# Altium schematic sheet Mcu.SchDoc
size A2
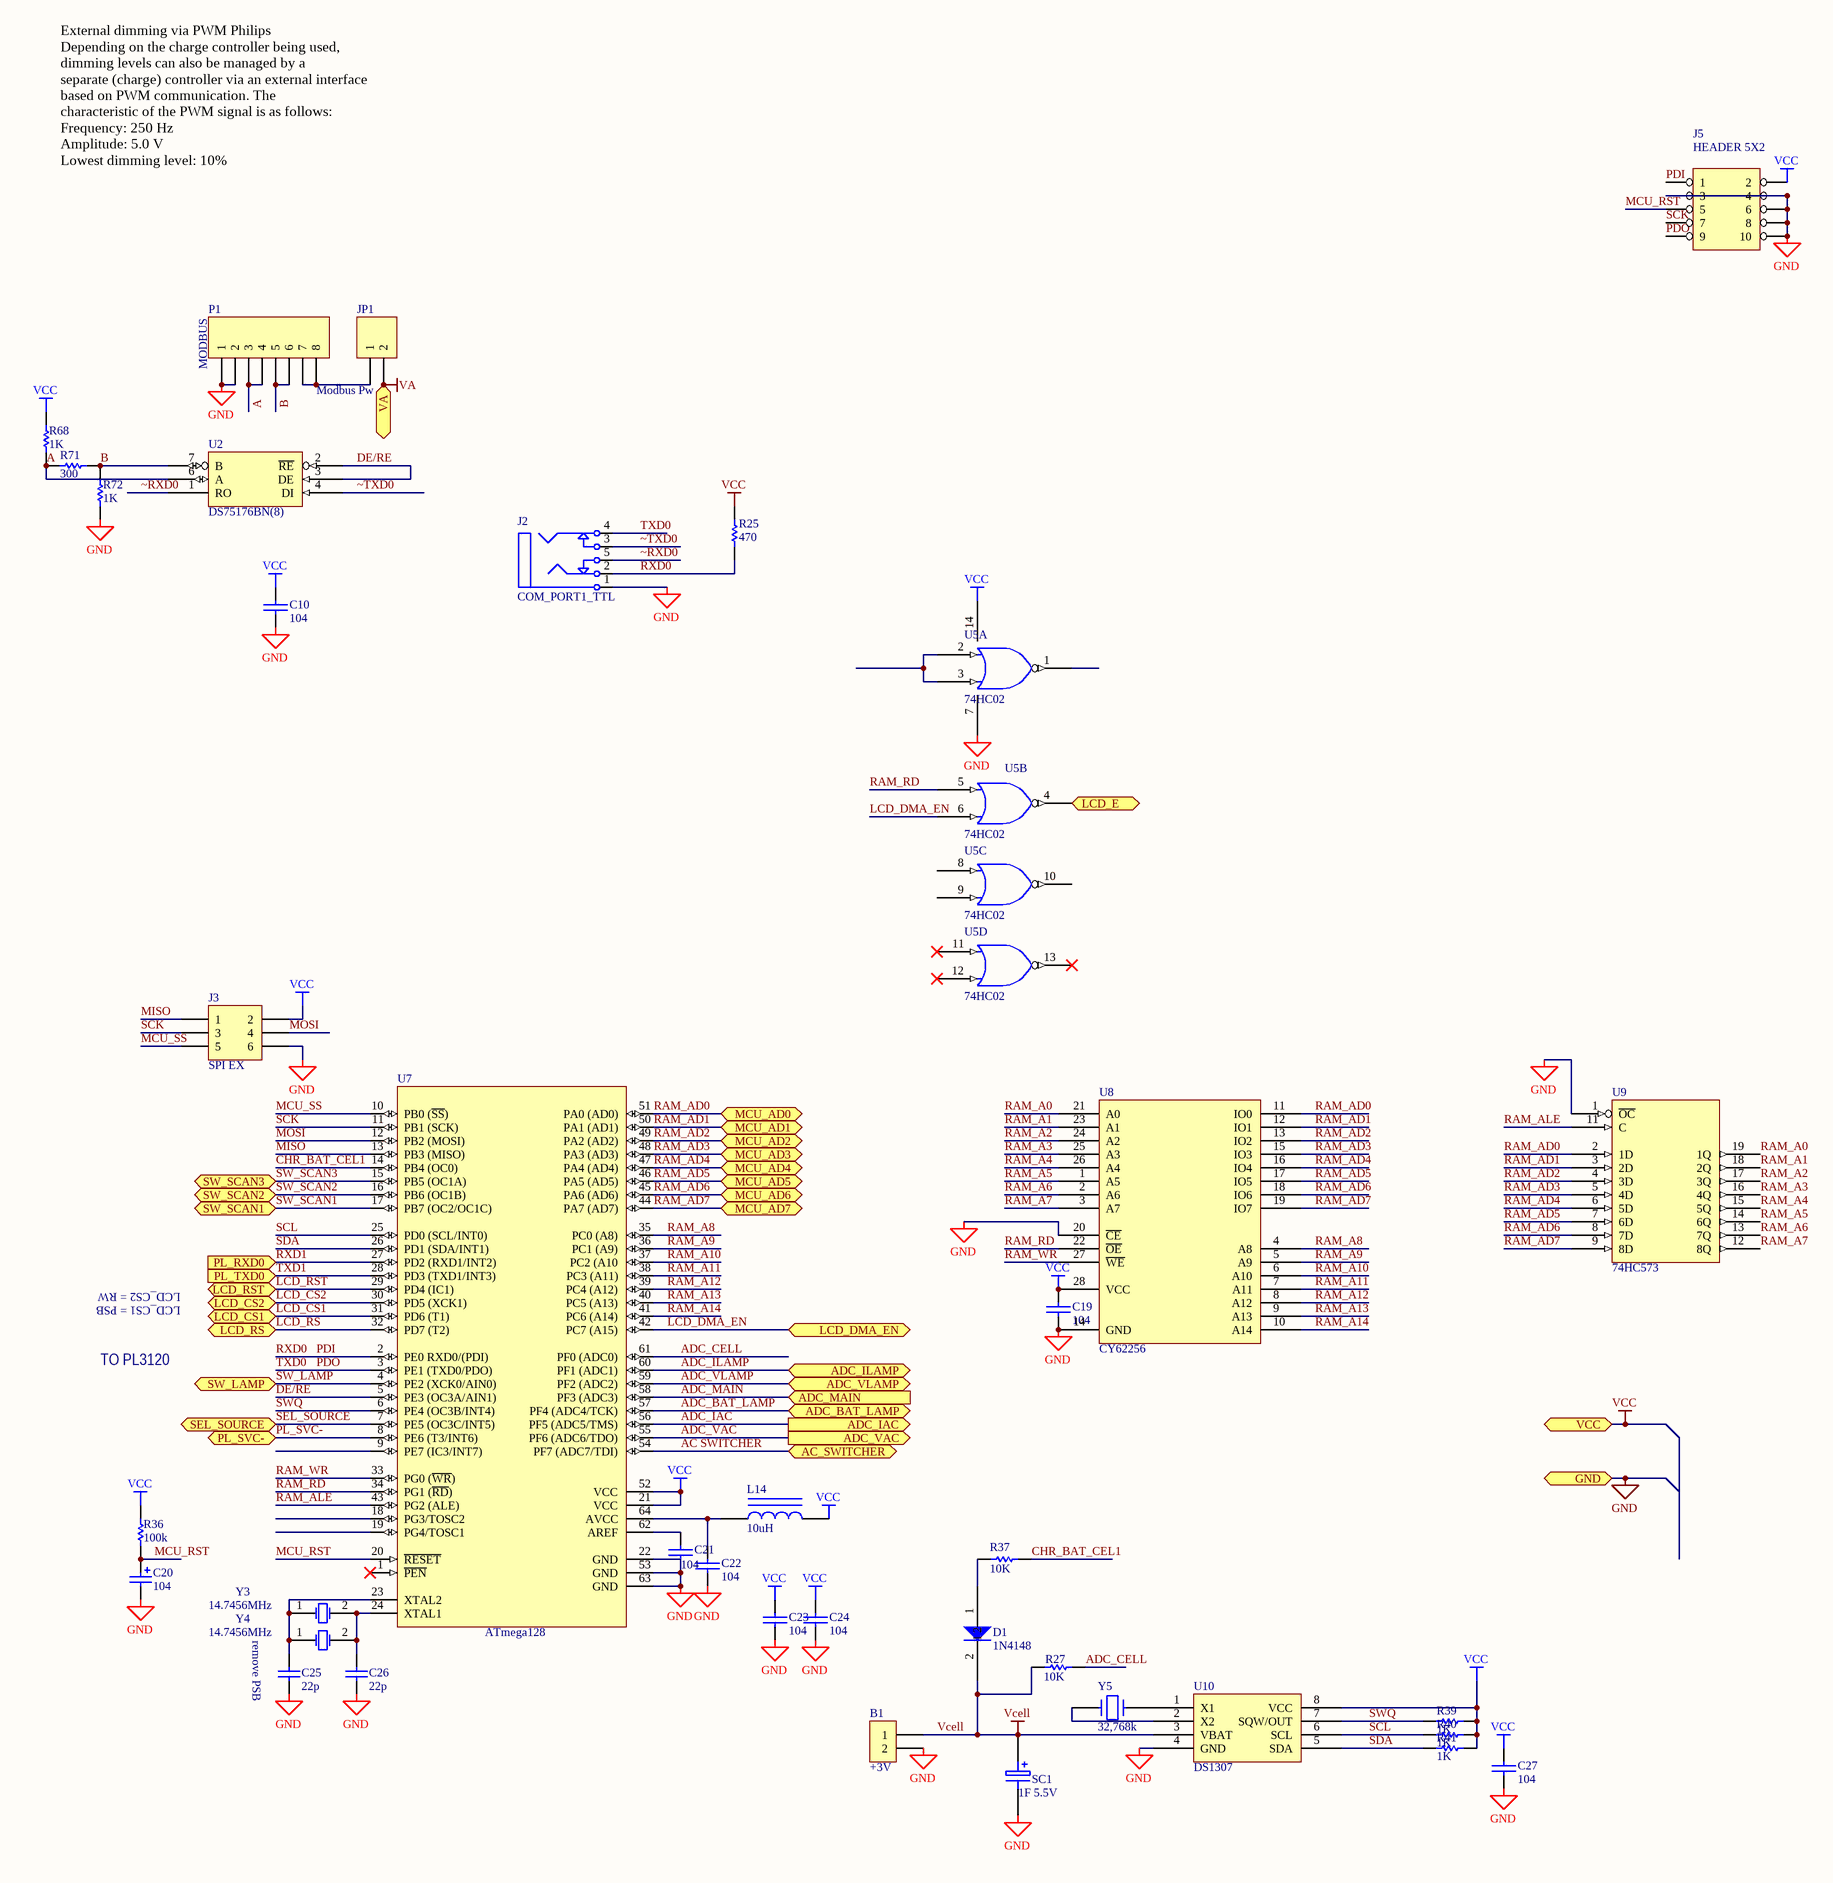
[diagram p0: Mcu.SchDoc]

## Parts
B1  +3V  [pincucao]
C10  104  [6-0805_N]
C19  104  [6-0805_N]
C20  104  [6-0805_N]
C21  104  [6-0805_N]
C22  104  [6-0805_N]
C23  104  [6-0805_N]
C24  104  [6-0805_N]
C25  22p  [6-0805_N]
C26  22p  [6-0805_N]
C27  104  [6-0805_N]
D1  1N4148  [SOD-80/MLL34]
J2  COM_PORT1_TTL  [SJ-3515]
J3  SPI EX  [HDR2X3]
J5  HEADER 5X2  [IDC10]
JP1  Modbus Pw  [HDR1X2]
L14  10uH  [6-0805_N]
P1  MODBUS  [BU_TEL8H_AMP]
R25  470  [6-0805_N]
R27  10K  [3216[1206]]
R36  100k  [6-0805_N]
R37  10K  [3216[1206]]
R39  1K  [6-0805_N]
R40  1K  [6-0805_N]
R41  1K  [6-0805_N]
R68  1K  [6-0805_N]
R71  300  [6-0805_N]
R72  1K  [6-0805_N]
SC1  1F 5.5V  [SUPERCAP]
U2  DS75176BN(8)  [SO8]
U5  74HC02  [SO14]  (parts A,B,C,D of 4)
U7  ATmega128  [QFP64-3]
U8  CY62256  [SO28X]
U9  74HC573  [SO20W]
U10  DS1307  [SO8]
Y3  14.7456MHz  [XTAL]
Y4  14.7456MHz  [XTAL-SMD]
Y5  32,768k  [R38]

## Ports
AC_SWITCHER, ADC_BAT_LAMP, ADC_IAC, ADC_ILAMP, ADC_MAIN, ADC_VAC, ADC_VLAMP, GND, LCD_CS1, LCD_CS2, LCD_DMA_EN, LCD_E, LCD_RS, LCD_RST, MCU_AD0, MCU_AD1, MCU_AD2, MCU_AD3, MCU_AD4, MCU_AD5, MCU_AD6, MCU_AD7, PL_RXD0, PL_SVC-, PL_TXD0, SEL_SOURCE, SW_LAMP, SW_SCAN1, SW_SCAN2, SW_SCAN3, VA, VCC

## Nets
GND: B1.2 C10.2 C19.2 C20.2 C21.2 C22.1 C23.2 C24.2 C25.1 C26.1 C27.2 J2.1 J3.6 J5.3 J5.4 J5.6 J5.8 J5.10 P1.1 P1.2 R72.2 SC1.2 U2.5(GND) U5.7(GND) U7.22(GND) U7.53(GND) U7.63(GND) U8.14(GND) U8.20(~{CE}) U9.1(~{OC}) U9.10(GND) U10.4(GND) ; port GND
VA: JP1.2 ; port VA
VCC: C10.1 C19.1 C23.1 C24.1 C27.1 J3.2 J5.2 L14.1 R25.1 R36.2 R39.2 R40.2 R41.2 R68.1 U2.8(VCC) U5.14(VCC) U7.21(VCC) U7.52(VCC) U8.28(VCC) U9.20(VCC) U10.8(VCC) ; port VCC
Vcell: B1.1 D1.2 R27.2 SC1.1 U10.3(VBAT)
A: P1.3 P1.4 R68.2 R71.1 U2.6(A)
AC SWITCHER: U7.54(PF7_(ADC7/TDI)) ; port AC_SWITCHER
ADC_BAT_LAMP: U7.57(PF4_(ADC4/TCK)) ; port ADC_BAT_LAMP
ADC_CELL: R27.1 U7.61(PF0_(ADC0))
ADC_IAC: U7.56(PF5_(ADC5/TMS)) ; port ADC_IAC
ADC_ILAMP: U7.60(PF1_(ADC1)) ; port ADC_ILAMP
ADC_MAIN: U7.58(PF3_(ADC3)) ; port ADC_MAIN
ADC_VAC: U7.55(PF6_(ADC6/TDO)) ; port ADC_VAC
ADC_VLAMP: U7.59(PF2_(ADC2)) ; port ADC_VLAMP
B: P1.5 P1.6 R71.2 R72.1 U2.7(B)
CHR_BAT_CEL1: R37.1 U7.14(PB4_(OC0))
DE/RE: U2.2(~{RE}) U2.3(DE) U7.5(PE3_(OC3A/AIN1))
LCD_CS1: U7.31(PD6_(T1)) ; port LCD_CS1
LCD_CS2: U7.30(PD5_(XCK1)) ; port LCD_CS2
LCD_DMA_EN: U5.6 U7.42(PC7_(A15)) ; port LCD_DMA_EN
LCD_E: U5.4 ; port LCD_E
LCD_RS: U7.32(PD7_(T2)) ; port LCD_RS
LCD_RST: U7.29(PD4_(IC1)) ; port LCD_RST
MCU_RST: C20.1 J5.5 R36.1 U7.20(~{RESET})
MCU_SS: J3.5 U7.10(PB0_(~{SS}))
MISO: J3.1 U7.13(PB3_(MISO))
MOSI: J3.4 U7.12(PB2_(MOSI))
PDI: J2.2 J5.1 R25.2 U7.2(PE0_RXD0/(PDI))  [also labelled RXD0]
PDO: J2.4 J5.9 U7.3(PE1_(TXD0/PDO))  [also labelled TXD0]
PL_SVC-: U7.8(PE6_(T3/INT6)) ; port PL_SVC-
RAM_A0: U8.21(A0) U9.19(1Q)
RAM_A1: U8.23(A1) U9.18(2Q)
RAM_A2: U8.24(A2) U9.17(3Q)
RAM_A3: U8.25(A3) U9.16(4Q)
RAM_A4: U8.26(A4) U9.15(5Q)
RAM_A5: U8.1(A5) U9.14(6Q)
RAM_A6: U8.2(A6) U9.13(7Q)
RAM_A7: U8.3(A7) U9.12(8Q)
RAM_A8: U7.35(PC0_(A8)) U8.4(A8)
RAM_A9: U7.36(PC1_(A9)) U8.5(A9)
RAM_A10: U7.37(PC2_(A10) U8.6(A10)
RAM_A11: U7.38(PC3_(A11)) U8.7(A11)
RAM_A12: U7.39(PC4_(A12)) U8.8(A12)
RAM_A13: U7.40(PC5_(A13)) U8.9(A13)
RAM_A14: U7.41(PC6_(A14)) U8.10(A14)
RAM_AD0: U7.51(PA0_(AD0)) U8.11(IO0) U9.2(1D) ; port MCU_AD0
RAM_AD1: U7.50(PA1_(AD1)) U8.12(IO1) U9.3(2D) ; port MCU_AD1
RAM_AD2: U7.49(PA2_(AD2)) U8.13(IO2) U9.4(3D) ; port MCU_AD2
RAM_AD3: U7.48(PA3_(AD3)) U8.15(IO3) U9.5(4D) ; port MCU_AD3
RAM_AD4: U7.47(PA4_(AD4)) U8.16(IO4) U9.6(5D) ; port MCU_AD4
RAM_AD5: U7.46(PA5_(AD5)) U8.17(IO5) U9.7(6D) ; port MCU_AD5
RAM_AD6: U7.45(PA6_(AD6)) U8.18(IO6) U9.8(7D) ; port MCU_AD6
RAM_AD7: U7.44(PA7_(AD7)) U8.19(IO7) U9.9(8D) ; port MCU_AD7
RAM_ALE: U7.43(PG2_(ALE)) U9.11(C)
RAM_RD: U5.5 U7.34(PG1_(~{RD})) U8.22(~{OE})
RAM_WR: U7.33(PG0_(~{WR})) U8.27(~{WE})
RXD1: U7.27(PD2_(RXD1/INT2)) ; port PL_RXD0
SCK: J3.3 J5.7 U7.11(PB1_(SCK))
SCL: R40.1 U7.25(PD0_(SCL/INT0)) U10.6(SCL)
SDA: R41.1 U7.26(PD1_(SDA/INT1)) U10.5(SDA)
SEL_SOURCE: U7.7(PE5_(OC3C/INT5)) ; port SEL_SOURCE
SW_LAMP: U7.4(PE2_(XCK0/AIN0)) ; port SW_LAMP
SW_SCAN1: U7.17(PB7_(OC2/OC1C)) ; port SW_SCAN1
SW_SCAN2: U7.16(PB6_(OC1B)) ; port SW_SCAN2
SW_SCAN3: U7.15(PB5_(OC1A)) ; port SW_SCAN3
SWQ: R39.1 U7.6(PE4_(OC3B/INT4)) U10.7(SQW/OUT)
TXD1: U7.28(PD3_(TXD1/INT3)) ; port PL_TXD0
~RXD0: J2.5 U2.1(RO)
~TXD0: J2.3 U2.4(DI)
NetC21_1: C21.1 U7.62(AREF)
NetC22_2: C22.2 L14.2 U7.64(AVCC)
NetC25_2: C25.2 U7.23(XTAL2) Y3.1(OSC1) Y4.1(OSC1)
NetC26_2: C26.2 U7.24(XTAL1) Y3.2(OSC2) Y4.2(OSC2)
NetD1_1: D1.1 R37.2
NetJP1_1: JP1.1 P1.7 P1.8
NetU5_2: U5.2 U5.3
NetU10_1: U10.1(X1) Y5.1
NetU10_2: U10.2(X2) Y5.2

Not connected (* = marked no-connect by the designer): J2 1A 1B 2A 2B 3A 3B 4A 4B 5A 5B; U5 1 8 9 10 11* 12* 13*; U7 1(~{PEN})* 9(PE7_(IC3/INT7)) 18(PG3/TOSC2) 19(PG4/TOSC1)

## Notes on the sheet
- External dimming via PWM Philips
  Depending on the charge controller being used, dimming levels can also be managed by a
  separate (charge) controller via an external interface based on PWM communication. The
  characteristic of the PWM signal is as follows:
  Frequency: 250 Hz
  Amplitude: 5.0 V
  Lowest dimming level: 10%
- LCD_CS1 = PSB
- LCD_CS2 = RW
- TO PL3120
- (near C25) remove PSB

## Library data of the parts
B1 = CON2: Connector
C10 C19 C21-C24 C27 = CAP: Capacitor
C20 = Cap Pol1: Polarized Capacitor (Radial); Published: *; LatestRevisionDate: *; LatestRevisionNote: *; PackageReference: *; Publisher: *; Value: *
C25 C26 = Cap: Capacitor; Value: 22 pF; Published: 8-Jun-2000; LatestRevisionDate: 17-Jul-2002; LatestRevisionNote: Re-released for DXP Platform.; PackageReference: RAD-0.3; Publisher: Altium Limited
D1 = DIODE
J2 = Phonejack Stereo SW: 3-Conductor Jack with 2 break contacts (normals) and 2 auxiliary make contacts; Published: 5-Jan-2004; LatestRevisionDate: 17-Dec-2003; LatestRevisionNote: PCB Footprint replaced.; DatasheetDocument: 07-Mar-2000; Publisher: Altium Limited; ComponentLink1Description: Manufacturer Link; ComponentLink1URL: http://domino.kycon.com/internet/Products.html
J3 = Header 3X2: Header, 3-Pin, Dual row; LatestRevisionDate: 17-Jul-2002; LatestRevisionNote: Re-released for DXP Platform.; Publisher: Altium Limited
JP1 = Header 2: Header, 2-Pin; LatestRevisionDate: 17-Jul-2002; LatestRevisionNote: Re-released for DXP Platform.; Publisher: Altium Limited
L14 = INDUCTOR IRON
P1 = Header 8: Header, 8-Pin; LatestRevisionDate: 17-Jul-2002; LatestRevisionNote: Re-released for DXP Platform.; Publisher: Altium Limited
R25 R27 R36 R37 R39-R41 R68 R71 R72 = Res Semi: Semiconductor Resistor; Published: *; LatestRevisionDate: *; LatestRevisionNote: *; PackageReference: *; Publisher: *; Value: *
SC1 = ELECTRO1: Electrolytic Capacitor
U2 = DS75176BN(8): Multipoint RS-485/RS-422 Transceivers
U5 = 74LS02
U7 = ATmega64-16AC: 8-Bit AVR Microcontroller with 64K Bytes of In-System Programmable Flash Memory; Published: 17-Sep-2003; LatestRevisionDate: 13-Apr-2006; LatestRevisionNote: IPC-7351 Footprint Added.; DatasheetVersion: 2490C-AVR-009/02; PackageVersion: revB, Oct-2001; PackageReference: 64A; Publisher: Altium Limited; PackageDescription: 64-Pin Thin Quad Flat Pack 0.8 mm Pitch; Code_JEDEC: MS-026-AEB; ComponentLink1Description: Manufacturer Link; ComponentLink1URL: http://www.atmel.com; ComponentLink2Description: Datasheet; ComponentLink2URL: http://www.atmel.com/dyn/resources/prod_documents/doc2490.pdf
Y3 Y4 = XTAL: Crystal Oscillator; Published: 8-Jun-2000; LatestRevisionDate: 17-Jul-2002; LatestRevisionNote: Re-released for DXP Platform.; PackageReference: R38; Publisher: Altium Limited
Y5 = CRYSTAL